# Altium project PCB_SensorBoard.PrjPcb
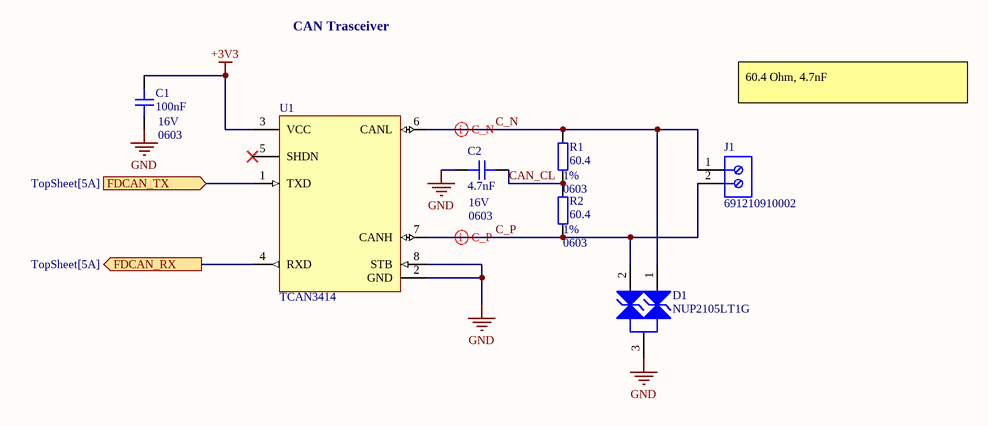
[diagram p0: CAN_Transceiver.SchDoc]
2 sheets, 13 parts. Net scope: flat (ports and power ports of the same name join across sheets).
Board file: PCB_SensorBoard.PcbDoc
Sheets:
  CAN_Transceiver.SchDoc
  Antenna.SchDoc

## Sheet CAN_Transceiver.SchDoc
size A4; SheetNumber: 2; SheetTotal: 3

### Parts
C1  value 100nF  Voltage - Rated: 16V  Package / Case: 0603  [0603_C]  (hidden comment: KGM15AR71C104KM)
C2  value 4.7nF  Voltage - Rated: 16V  Package / Case: 0603  [0603_C]  (hidden comment: KGM15AR71C472KT)
D1  NUP2105LT1G  [ONSC-SOT-23-3-318-08_V]
J1  691210910002  [691210910002]
R1  value 60.4  Tolerance: 1%  Package / Case: 0603  [0603_R]  (hidden comment: RC0603FR-0760R4L)
R2  value 60.4  Tolerance: 1%  Package / Case: 0603  [0603_R]  (hidden comment: RC0603FR-0760R4L)
U1  TCAN3414  [SOIC-8NB]

### Ports
FDCAN_RX (out, see TopSheet[5A]), FDCAN_TX (in, see TopSheet[5A])

### Nets
+3V3: C1.2 U1.3(VCC)
GND: C1.1 C2.1 D1.3(K) U1.2(GND) U1.8(STB)
C_N: D1.1(K) J1.1 R1.2 U1.6(CANL)
C_P: D1.2(K) J1.2 R2.1 U1.7(CANH)
CAN_CL: C2.2 R1.1 R2.2
NetU1_1: U1.1(TXD) ; port FDCAN_TX
NetU1_4: U1.4(RXD) ; port FDCAN_RX

Not connected (* = marked no-connect by the designer): U1 5(SHDN)*

### Layout directives
differential pair; differential pair class C: C_N, C_P

### Notes on the sheet
- CAN Trasceiver
- 60.4 Ohm, 4.7nF

### Library data of the parts
C1 = CMP-001-00851-1: CAP CER 0.1UF 16V X7R 0603; Manufacture: KYOCERA AVX; Tolerance: 10%; Product Status: Active; Mounting Type: Surface Mount, MLCC; Case/Package: Tape & Reel (TR),Cut Tape (CT),Digi-Reel®; Temperature Coefficient: X7R; Applications: General Purpose; Thickness (Max): 0.035" (0.90mm); Manufacture Part Number: KGM15AR71C104KM; Size / Dimension: 0.063" L x 0.032" W (1.60mm x 0.81mm); Operating Temperature: -55°C ~ 125°C; Series: KGM - X7R
C2 = CMP-001-01878-1: CAP CER 4700PF 16V X7R 0603; Manufacture: KYOCERA AVX; Product Status: Active; Tolerance: 10%; Mounting Type: Surface Mount, MLCC; Series: KGM - X7R; Applications: General Purpose; Thickness (Max): 0.035" (0.90mm); Manufacture Part Number: KGM15AR71C472KT; Operating Temperature: -55°C ~ 125°C; Temperature Coefficient: X7R; Case/Package: Tape & Reel (TR),Cut Tape (CT),Digi-Reel®; Size / Dimension: 0.063" L x 0.032" W (1.60mm x 0.81mm)
D1 = CMP-1063-00164-1: Dual Line CAN Bus Protector, 3-Pin SOT-23, Pb-Free, Tape and Reel; Manufacturer: On Semiconductor; IR Max (uA): 0.1; Number of Lines: 2; Direction: Bidirectional; C Max (pF): 30; PPK Max (W): 350; V(BR) Min (V): 26.2; ComponentLink3URL: http://www.onsemi.cn/pub_link/Collateral/318-08.PDF; Mounting Technology: Surface Mount; ComponentLink2Description: Datasheet; PartNumber: NUP2105LT1G; ComponentLink1URL: http://www.onsemi.com/; PackageVersion: Rev. AP, 11/2009; DatasheetVersion: Rev. 5; RoHS: Pb-Free; PackageReference: SOT-23-3-318-08; ComponentLink2URL: http://www.onsemi.cn/pub_link/Collateral/NUP2105L-D.PDF; ComponentLink1Description: Manufacturer URL; PackageDescription: 3-Pin Small Outline Transistor, Body 2.92 x 1.3 mm, Pitch 0.95 mm; Packing: Tape and Reel; ComponentLink3Description: Package Specification
J1 = CMP-1502-02456-2: NexarPartId: 105950649; Current Rating: 6A; Voltage Rating: 150V; Number of Contacts: 2; Number of Rows: 1; Contact Material: Tin; Height: 8.7mm; Max Operating Temperature: 105°C; Min Operating Temperature: -40°C
R1 R2 = CMP-009-00563-1: RES 60.4 OHM 1% 1/10W 0603; Manufacture: YAGEO; Product Status: Active; Power (Watts): 0.1W, 1/10W; Temperature Coefficient: ±100ppm/°C; Size / Dimension: 0.063" L x 0.031" W (1.60mm x 0.80mm); Case/Package: Tape & Reel (TR),Cut Tape (CT),Digi-Reel®; Composition: Thick Film; Manufacture Part Number: RC0603FR-0760R4L; Features: Moisture Resistant; Series: RC_L; Height - Seated (Max): 0.022" (0.55mm); Number of Terminations: 2; Operating Temperature: -55°C ~ 155°C
U1 = TCAN3414: Supplier 1: Mouser; Supplier Part Number 1: 595-TCAN3414DR

## Sheet Antenna.SchDoc
size A4; SheetNumber: 3; SheetTotal: 3
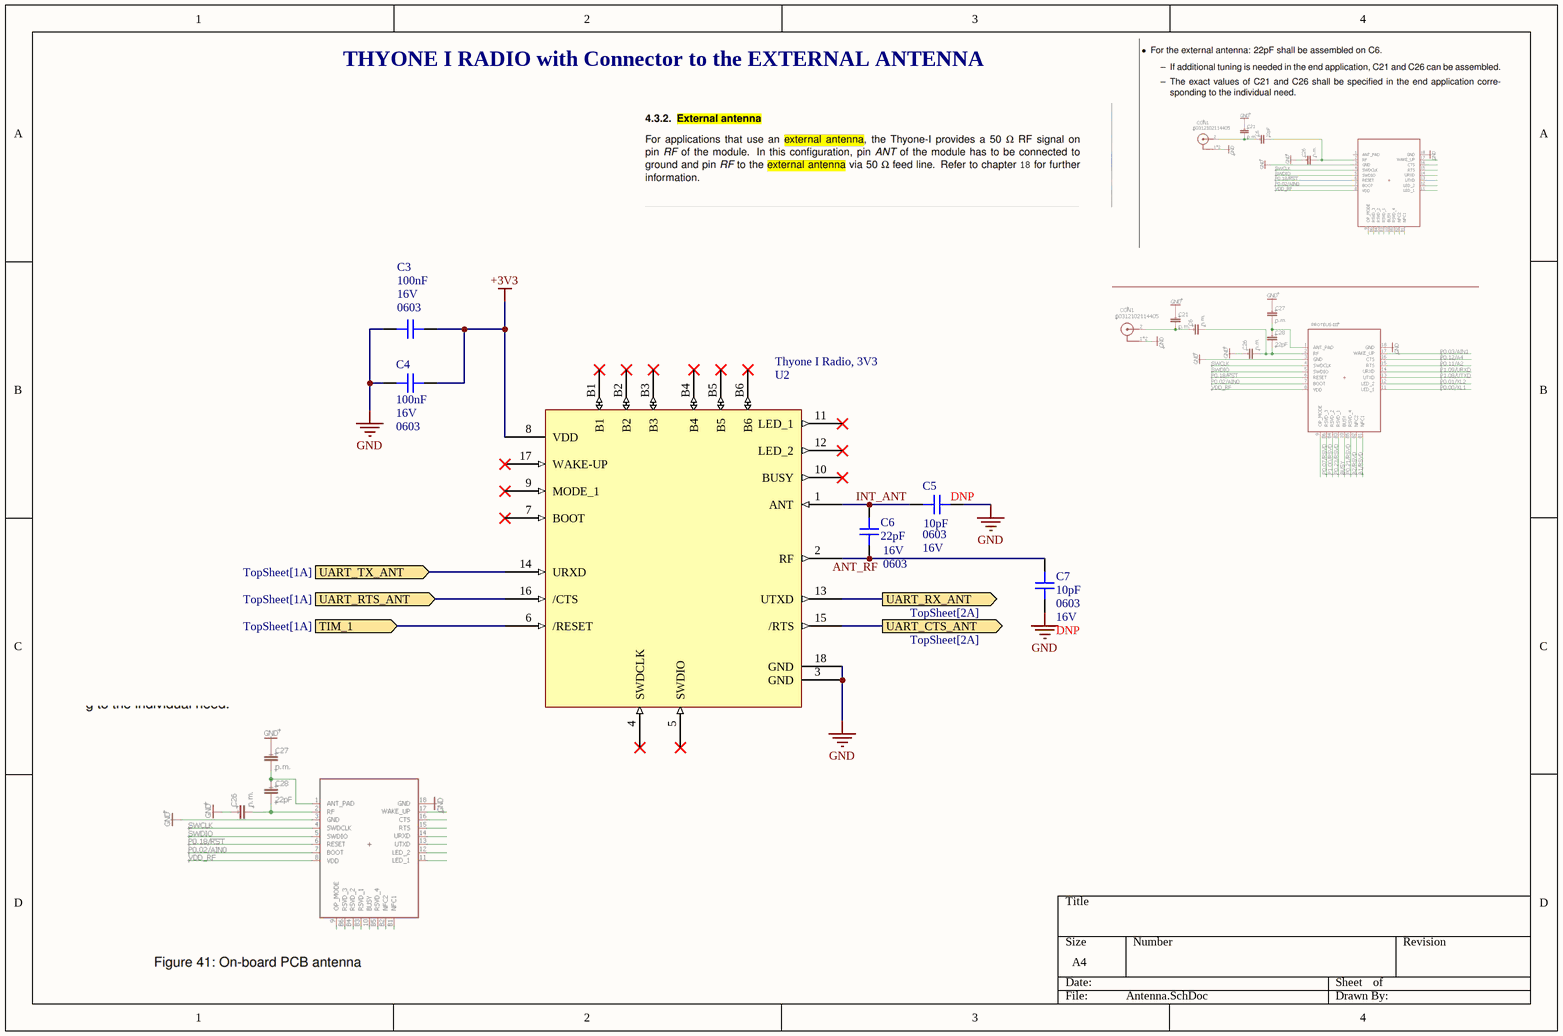
[diagram p1: Antenna.SchDoc]

### Parts
C3  value 100nF  Voltage - Rated: 16V  Package / Case: 0603  [0603_C]  (hidden comment: KGM15AR71C104KM)
C4  value 100nF  Voltage - Rated: 16V  Package / Case: 0603  [0603_C]  (hidden comment: KGM15AR71C104KM)
C5  DNP  value 10pF  Package / Case: 0603  Voltage - Rated: 16V  [0603_C]
C6  value 22pF  Voltage - Rated: 16V  Package / Case: 0603  [0603_C]  (hidden comment: KGM15ACG1C220KT)
C7  DNP  value 10pF  Package / Case: 0603  Voltage - Rated: 16V  [0603_C]
U2  Thyone I Radio, 3V3  [WE-FP-4+]

### Ports
TIM_1 (in, see TopSheet[1A]), UART_CTS_ANT (out, see TopSheet[2A]), UART_RTS_ANT (in, see TopSheet[1A]), UART_RX_ANT (out, see TopSheet[2A]), UART_TX_ANT (in, see TopSheet[1A])

### Nets
+3V3: C3.2 C4.1 U2.8(VDD)
GND: C3.1 C4.2 C5.1 C7.2 U2.3(GND) U2.18(GND)
ANT_RF: C6.1 C7.1 U2.2(RF)
INT_ANT: C5.2 C6.2 U2.1(ANT)
NetU2_6: U2.6(/RESET) ; port TIM_1
NetU2_13: U2.13(UTXD) ; port UART_RX_ANT
NetU2_14: U2.14(URXD) ; port UART_TX_ANT
NetU2_15: U2.15(/RTS) ; port UART_CTS_ANT
NetU2_16: U2.16(/CTS) ; port UART_RTS_ANT

Not connected (* = marked no-connect by the designer): U2 4(SWDCLK)* 5(SWDIO)* 7(BOOT)* 9(MODE_1)* 10(BUSY)* 11(LED_1)* 12(LED_2)* 17(WAKE-UP)* B1* B2* B3* B4* B5* B6*

### Notes on the sheet
- THYONE I RADIO with Connector to the EXTERNAL ANTENNA

### Library data of the parts
C3 C4 = CMP-001-00851-1: as C1 on sheet CAN_Transceiver; Mounting Type: Surface Mount, MLCC; Case/Package: Tape & Reel (TR),Cut Tape (CT),Digi-Reel®; Temperature Coefficient: X7R; Applications: General Purpose; Thickness (Max): 0.035" (0.90mm); Manufacture Part Number: KGM15AR71C104KM; Size / Dimension: 0.063" L x 0.032" W (1.60mm x 0.81mm); Operating Temperature: -55°C ~ 125°C; Series: KGM - X7R
C5 C7 = CMP-001-00327-1: CAP CER 10PF 16V C0G/NP0 0603; Manufacture Part Number: KGM15ACG1C100JT; Manufacture: KYOCERA AVX; Tolerance: 5%; Product Status: Active; Temperature Coefficient: C0G, NP0; Thickness (Max): 0.035" (0.90mm); Applications: General Purpose; Operating Temperature: -55°C ~ 125°C; Case/Package: Tape & Reel (TR),Cut Tape (CT),Digi-Reel®; Size / Dimension: 0.063" L x 0.032" W (1.60mm x 0.81mm); Series: KGM - C0G; Mounting Type: Surface Mount, MLCC
C6 = CMP-001-00865-1: CAP CER 22PF 16V C0G/NP0 0603; Manufacture: KYOCERA AVX; Temperature Coefficient: C0G, NP0; Product Status: Active; Tolerance: 10%; Mounting Type: Surface Mount, MLCC; Case/Package: Tape & Reel (TR),Cut Tape (CT),Digi-Reel®; Manufacture Part Number: KGM15ACG1C220KT; Operating Temperature: -55°C ~ 125°C; Size / Dimension: 0.063" L x 0.032" W (1.60mm x 0.81mm); Thickness (Max): 0.035" (0.90mm); Series: KGM - C0G; Applications: General Purpose
U2 = 2611011021000: Supplier 1: Mouser; Supplier Part Number 1: 710-2611011021000

## Nets that join several sheets
+3V3: CAN_Transceiver (C1.2 U1.3), Antenna (C3.2 C4.1 U2.8)
GND: CAN_Transceiver (5 pins), Antenna (6 pins)